# EAGLE schematic M8830Ccpld (EAGLE 6.6.0)
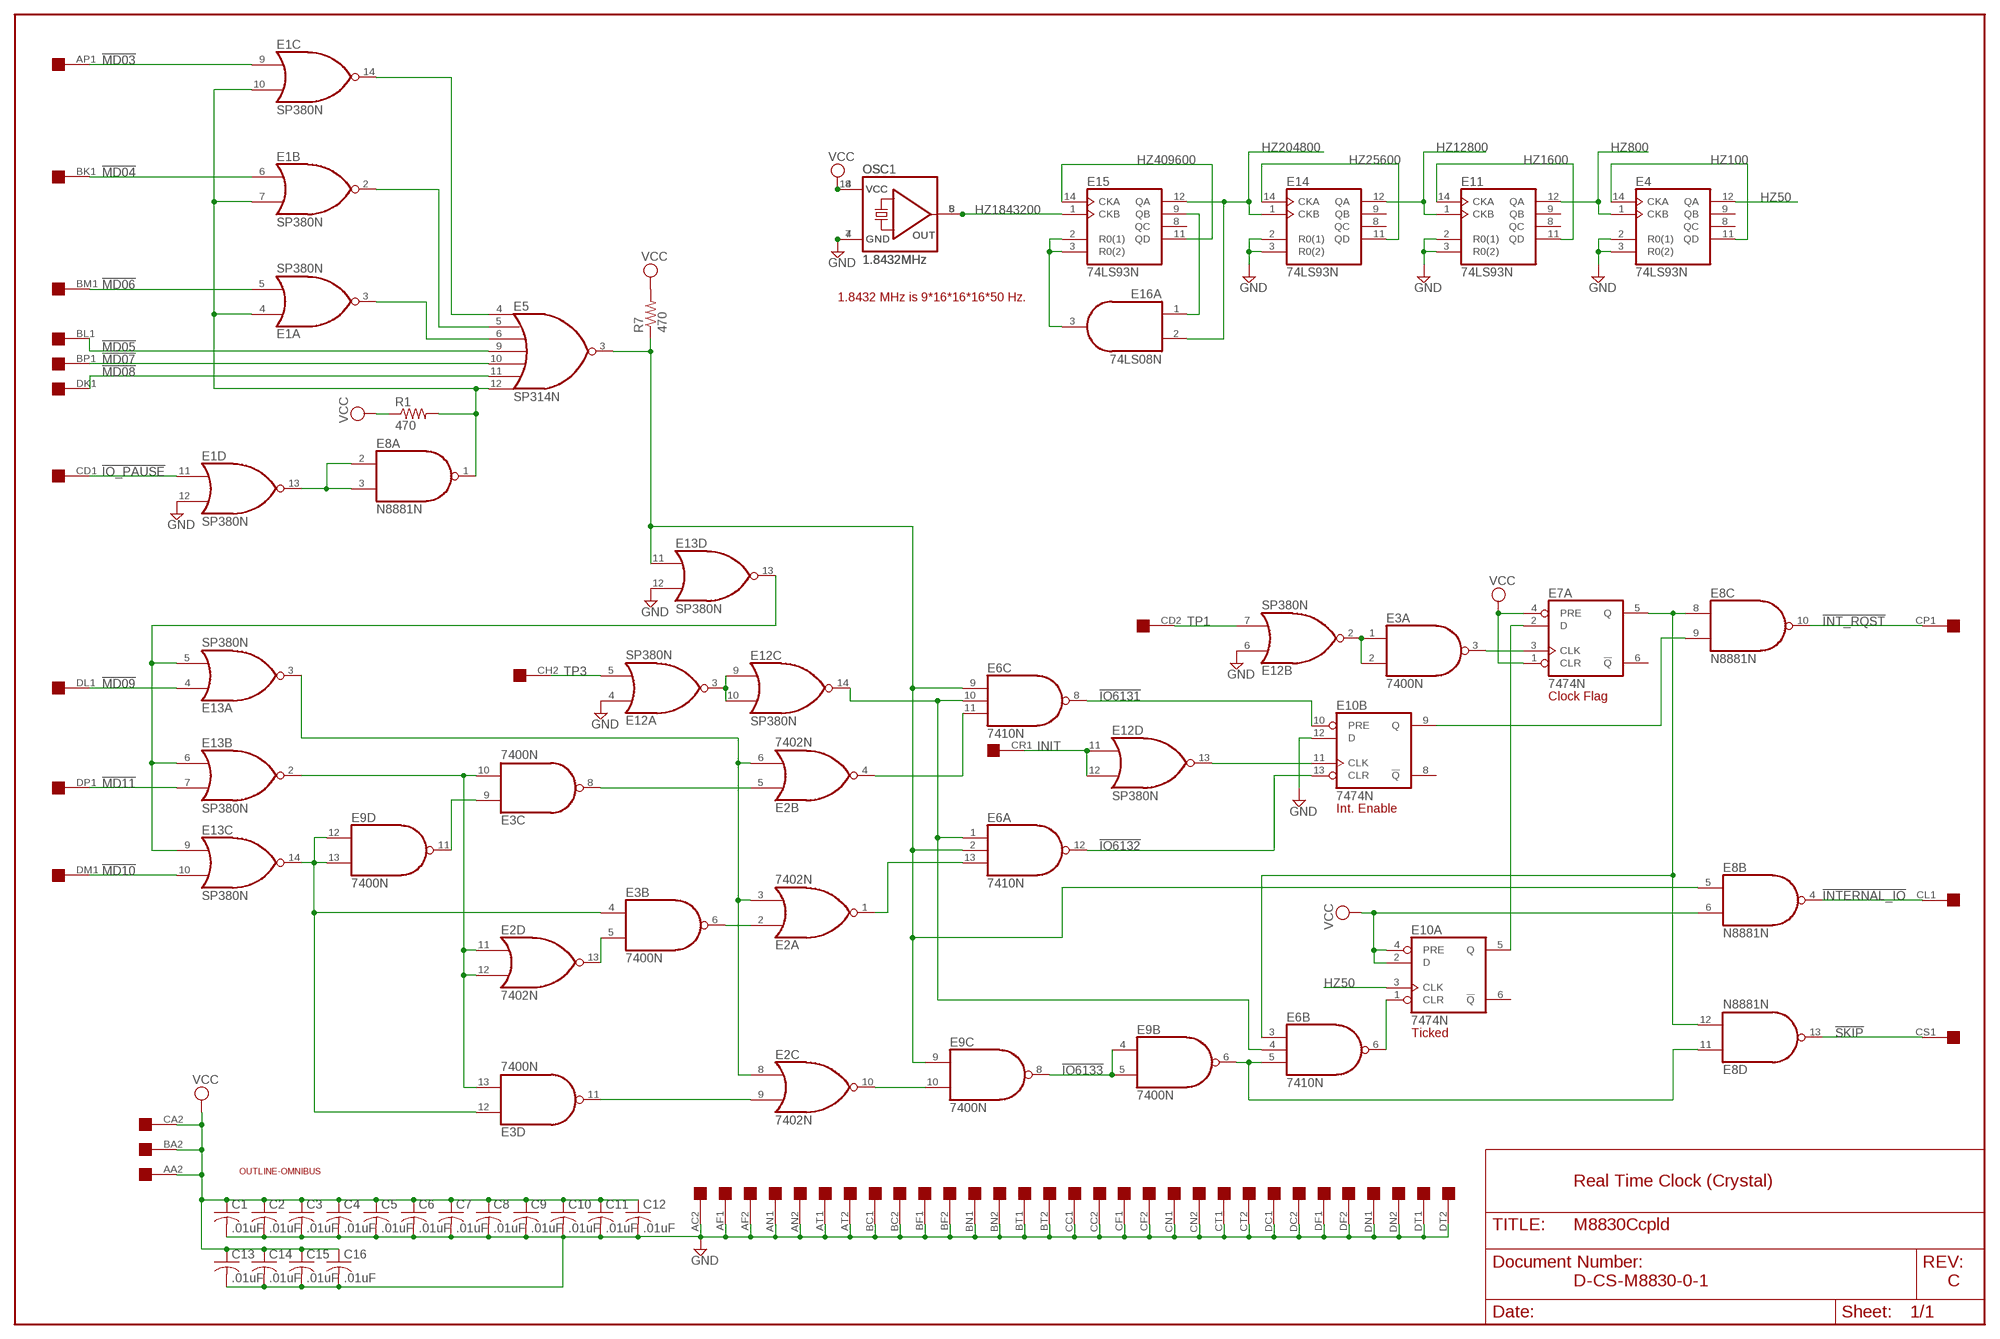
[diagram p0: schematic, sheet 1]

## Parts
C1  .01uF  C-US050-025X075  [C050-025X075]
C2  .01uF  C-US050-025X075  [C050-025X075]
C3  .01uF  C-US050-025X075  [C050-025X075]
C4  .01uF  C-US050-025X075  [C050-025X075]
C5  .01uF  C-US050-025X075  [C050-025X075]
C6  .01uF  C-US050-025X075  [C050-025X075]
C7  .01uF  C-US050-025X075  [C050-025X075]
C8  .01uF  C-US050-025X075  [C050-025X075]
C9  .01uF  C-US050-025X075  [C050-025X075]
C10  .01uF  C-US050-025X075  [C050-025X075]
C11  .01uF  C-US050-025X075  [C050-025X075]
C12  .01uF  C-US050-025X075  [C050-025X075]
C13  .01uF  C-US050-025X075  [C050-025X075]
C14  .01uF  C-US050-025X075  [C050-025X075]
C15  .01uF  C-US050-025X075  [C050-025X075]
C16  .01uF  C-US050-025X075  [C050-025X075]
E1  SP380N  [DIL14]
E2  7402N  [DIL14]
E3  7400N  [DIL14]
E4  74LS93N  [DIL14]
E5  SP314N  [DIL14]
E6  7410N  [DIL14]
E7  7474N  74S74N  [DIL14]
E8  N8881N  [DIL14]
E9  7400N  [DIL14]
E10  7474N  74S74N  [DIL14]
E11  74LS93N  [DIL14]
E12  SP380N  [DIL14]
E13  SP380N  [DIL14]
E14  74LS93N  [DIL14]
E15  74LS93N  [DIL14]
E16  74LS08N  [DIL14]
EDGE  QUAD  [EDGE-CON8]
OSC  1.8432MHz  QG5460  [DIL08S]
OSC1  1.8432MHz  QG5860  [DIL14S]
R1  470  R-US_0207/10  [0207/10]
R7  470  R-US_0207/10  [0207/10]
U$1  OUTLINE-OMNIBUS  [OMNIBUS]

## Nets
!BIOPAUSE: E1.4(A:I0) E1.7(B:I1) E1.10(C:I1) E5.12(I6) E8.1(A:O) R1.2
!DO_CLSK: E6.6(B:O) E10.1(A:CLR)
!INIT: E10.11(B:CLK) E12.13(D:O)
!INT_RQST: E8.10(C:O) EDGE.CP1
!INTERNAL_IO: E8.4(B:O) EDGE.CL1
!IO6131: E6.8(C:O) E10.10(B:PRE)
!IO6132: E6.12(A:O) E10.13(B:CLR)
!IO6133: E9.4(B:I0) E9.5(B:I1) E9.8(C:O)
!IO_PAUSE: E1.11(D:I0) EDGE.CD1
!MAYBE_CLEI: E2.5(B:I0) E3.8(C:O)
!MAYBE_CLSK: E2.9(C:I1) E3.11(D:O)
!MAYBECLDI: E2.2(A:I0) E3.6(B:O)
!MD03: E1.9(C:I0) EDGE.AP1
!MD04: E1.6(B:I0) EDGE.BK1
!MD05: E5.9(I3) EDGE.BL1
!MD06: E1.5(A:I1) EDGE.BM1
!MD07: E5.10(I4) EDGE.BP1
!MD08: E5.11(I5) EDGE.DK1
!MD09: E13.4(A:I0) EDGE.DL1
!MD10: E13.10(C:I1) EDGE.DM1
!MD11: E13.7(B:I1) EDGE.DP1
!MYIOT: E13.5(A:I1) E13.6(B:I0) E13.9(C:I0) E13.13(D:O)
!MYMD10: E3.9(C:I0) E9.11(D:O)
!MYMD11: E2.13(D:O) E3.5(B:I1)
!SKIP: E8.13(D:O) EDGE.CS1
!TP1: E3.1(A:I0) E3.2(A:I1) E12.2(B:O)
!TP3: E12.3(A:O) E12.9(C:I0) E12.10(C:I1)
BTP1: E3.3(A:O) E7.3(A:CLK)
BTP3: E6.1(A:I0) E6.4(B:I1) E6.10(C:I1) E12.14(C:O)
CK_FLAG: E6.3(B:I0) E7.5(A:Q) E8.8(C:I0) E8.12(D:I1)
CLDI: E2.1(A:O) E6.13(A:I2)
CLIE: E2.4(B:O) E6.11(C:I2)
CLSK: E2.10(C:O) E9.10(C:I1)
GND: C1.2 C2.2 C3.2 C4.2 C5.2 C6.2 C7.2 C8.2 C9.2 C10.2 C11.2 C12.2 C13.2 C14.2 C15.2 C16.2 E1.12(D:I1) E4.2(R0(1)) E4.3(R0(2)) E10.12(B:D) E11.2(R0(1)) E11.3(R0(2)) E12.4(A:I0) E12.6(B:I0) E13.12(D:I1) E14.2(R0(1)) E14.3(R0(2)) EDGE.AC2 EDGE.AF1 EDGE.AF2 EDGE.AN1 EDGE.AN2 EDGE.AT1 EDGE.AT2 EDGE.BC1 EDGE.BC2 EDGE.BF1 EDGE.BF2 EDGE.BN1 EDGE.BN2 EDGE.BT1 EDGE.BT2 EDGE.CC1 EDGE.CC2 EDGE.CF1 EDGE.CF2 EDGE.CN1 EDGE.CN2 EDGE.CT1 EDGE.CT2 EDGE.DC1 EDGE.DC2 EDGE.DF1 EDGE.DF2 EDGE.DN1 EDGE.DN2 EDGE.DT1 EDGE.DT2 OSC1.7(GND) OSC.4(GND)
HZ50: E4.12(QA) E10.3(A:CLK)
HZ100: E4.11(QD) E4.14(CKA)
HZ800: E4.1(CKB) E11.12(QA)
HZ1600: E11.11(QD) E11.14(CKA)
HZ12800: E11.1(CKB) E14.12(QA)
HZ25600: E14.11(QD) E14.14(CKA)
HZ204800: E14.1(CKB) E15.12(QA) E16.2(A:I1)
HZ409600: E15.11(QD) E15.14(CKA)
HZ1843200: E15.1(CKB) OSC1.8(OUT) OSC.5(OUT)
INIT: E12.11(D:I0) E12.12(D:I1) EDGE.CR1
IO6133: E6.5(B:I2) E8.11(D:I0) E9.6(B:O)
IO_PAUSE: E1.13(D:O) E8.2(A:I0) E8.3(A:I1)
IOPMD03: E1.14(C:O) E5.4(I0)
IOPMD04: E1.2(B:O) E5.5(I1)
IOPMD06: E1.3(A:O) E5.6(I2)
IRQ_ENABLE: E8.9(C:I1) E10.9(B:Q)
MYIOT: E5.3(O) E6.2(A:I1) E6.9(C:I0) E8.5(B:I0) E9.9(C:I0) E13.11(D:I0) R7.1
MYMD09: E2.3(A:I1) E2.6(B:I1) E2.8(C:I0) E13.3(A:O)
MYMD10: E3.4(B:I0) E3.12(D:I0) E9.12(D:I0) E9.13(D:I1) E13.14(C:O)
MYMD11: E2.11(D:I0) E2.12(D:I1) E3.10(C:I1) E3.13(D:I1) E13.2(B:O)
N$1: E15.9(QB) E16.1(A:I0)
N$6: E15.2(R0(1)) E15.3(R0(2)) E16.3(A:O)
TICKED: E7.2(A:D) E10.5(A:Q)
TP1: E12.7(B:I1) EDGE.CD2
TP3: E12.5(A:I1) EDGE.CH2
VCC: C1.1 C2.1 C3.1 C4.1 C5.1 C6.1 C7.1 C8.1 C9.1 C10.1 C11.1 C12.1 C13.1 C14.1 C15.1 C16.1 E7.1(A:CLR) E7.4(A:PRE) E8.6(B:I1) E10.2(A:D) E10.4(A:PRE) EDGE.AA2 EDGE.BA2 EDGE.CA2 OSC1.14(VCC) OSC.8(VCC) R1.1 R7.2
Unconnected: E4.8(QC) E4.9(QB) E7.6(A:!Q) E7.8(B:!Q) E7.9(B:Q) E7.10(B:PRE) E7.11(B:CLK) E7.12(B:D) E7.13(B:CLR) E9.1(A:I0) E9.2(A:I1) E9.3(A:O) E10.6(A:!Q) E10.8(B:!Q) E11.8(QC) E11.9(QB) E14.8(QC) E14.9(QB) E15.8(QC) E16.4(B:I0) E16.5(B:I1) E16.6(B:O) E16.8(C:O) E16.9(C:I0) E16.10(C:I1) E16.11(D:O) E16.12(D:I0) E16.13(D:I1) EDGE.AA1 EDGE.AB1 EDGE.AB2 EDGE.AC1 EDGE.AD1 EDGE.AD2 EDGE.AE1 EDGE.AE2 EDGE.AH1 EDGE.AH2 EDGE.AJ1 EDGE.AJ2 EDGE.AK1 EDGE.AK2 EDGE.AL1 EDGE.AL2 EDGE.AM1 EDGE.AM2 EDGE.AP2 EDGE.AR1 EDGE.AR2 EDGE.AS1 EDGE.AS2 EDGE.AU1 EDGE.AU2 EDGE.AV1 EDGE.AV2 EDGE.BA1 EDGE.BB1 EDGE.BB2 EDGE.BD1 EDGE.BD2 EDGE.BE1 EDGE.BE2 EDGE.BH1 EDGE.BH2 EDGE.BJ1 EDGE.BJ2 EDGE.BK2 EDGE.BL2 EDGE.BM2 EDGE.BP2 EDGE.BR1 EDGE.BR2 EDGE.BS1 EDGE.BS2 EDGE.BU1 EDGE.BU2 EDGE.BV1 EDGE.BV2 EDGE.CA1 EDGE.CB1 EDGE.CB2 EDGE.CE1 EDGE.CE2 EDGE.CH1 EDGE.CJ1 EDGE.CJ2 EDGE.CK1 EDGE.CK2 EDGE.CL2 EDGE.CM1 EDGE.CM2 EDGE.CP2 EDGE.CR2 EDGE.CS2 EDGE.CU1 EDGE.CU2 EDGE.CV1 EDGE.CV2 EDGE.DA1 EDGE.DA2 EDGE.DB1 EDGE.DB2 EDGE.DD1 EDGE.DD2 EDGE.DE1 EDGE.DE2 EDGE.DH1 EDGE.DH2 EDGE.DJ1 EDGE.DJ2 EDGE.DK2 EDGE.DL2 EDGE.DM2 EDGE.DP2 EDGE.DR1 EDGE.DR2 EDGE.DS1 EDGE.DS2 EDGE.DU1 EDGE.DU2 EDGE.DV1 EDGE.DV2

## Notes on the sheet
- 1.8432 MHz is 9*16*16*16*50 Hz.
- Clock Flag
- Int. Enable
- Ticked
- Real Time Clock (Crystal)
- D-CS-M8830-0-1 | C

## Power pins joined to a net without a drawn wire
GND: E1.1(P:GND) E2.7(P:GND) E3.7(P:GND) E4.10(GND) E5.1(GND) E6.7(P:GND) E7.7(P:GND) E8.7(P:GND) E9.7(P:GND) E10.7(P:GND) E11.10(GND) E12.1(P:GND) E13.1(P:GND) E14.10(GND) E15.10(GND) E16.7(P:GND)
VCC: E1.8(P:VCC) E2.14(P:VCC) E3.14(P:VCC) E4.5(VCC) E5.8(VCC) E6.14(P:VCC) E7.14(P:VCC) E8.14(P:VCC) E9.14(P:VCC) E10.14(P:VCC) E11.5(VCC) E12.8(P:VCC) E13.8(P:VCC) E14.5(VCC) E15.5(VCC) E16.14(P:VCC)

## Library data of the parts
C1-C16 = rcl:C-US: CAPACITOR, American symbol
E1 E12 E13 = dec-con:SP380: Quad NOR gate (use 8640)
E2 = 74xx-us:74*02: Quad 2-input NOR gate
E3 E9 = 74xx-us:74*00: Quad 2-input NAND gate
E4 E11 E14 E15 = 74xx-us:74*93: Decade, divide by twelve and binary COUNTER
E5 = dec-con:SP314: 7-Input NOR gate
E6 = 74xx-us:74*10: Triple 3-input NAND gate
E7 E10 = 74xx-us:74*74: Dual D type positive edge triggered FLIP FLOP, preset and clear
E8 = dec-con:N8881: Quad 2-input NAND gate, open collector
E16 = 74xx-us:74*08: Quad 2-input AND gate
EDGE = dec-con:QUAD: Quad-Height DEC board
OSC = crystal:QG5460: CRYSTAL RESONATOR; OC_FARNELL: unknown; OC_NEWARK: unknown
OSC1 = crystal:QG5860: CRYSTAL RESONATOR; OC_FARNELL: unknown; OC_NEWARK: unknown
R1 R7 = rcl:R-US_: RESISTOR, American symbol
U$1 = dec-con:OUTLINE-*: Board outlines for DEC boards.

## Net classes
0 default: width 0.813 mm